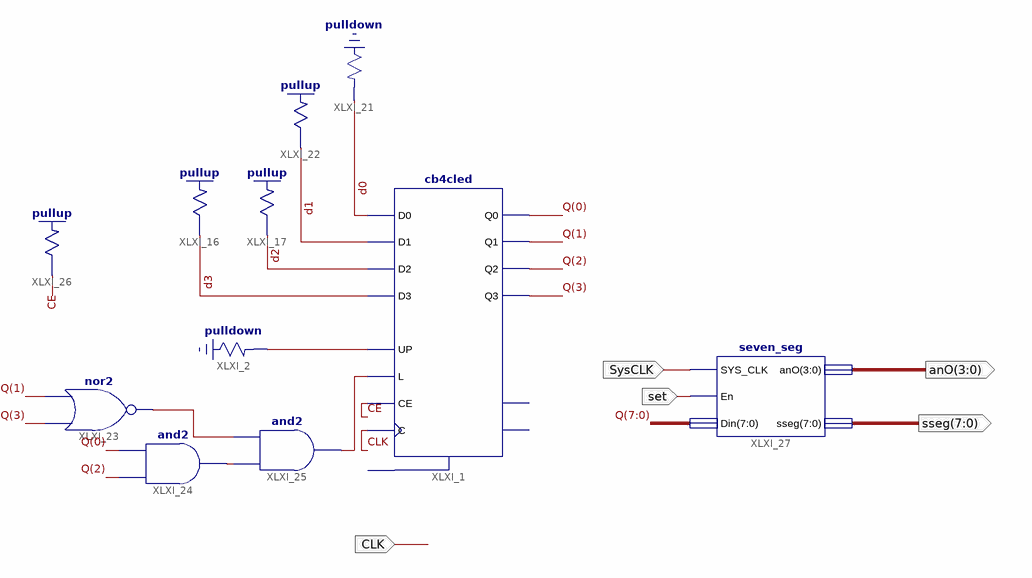
[diagram p0: schematic sheet 1]
// Xilinx ISE schematic Exp6.sch (spartan3e) as structural Verilog: 11 symbols, 5 ports
module Exp6 (
  input  CLK,
  input  set,
  input  SysCLK,
  output [7:0] sseg,
  output [3:0] anO
);

  wire CE, d0, d1, d2, d3, XLXN_25, XLXN_27, XLXN_28, XLXN_29;
  wire [7:0] Q;

  cb4cled XLXI_1 (
    .C(CLK), .CE(CE), .D0(d0), .D1(d1), .D2(d2), .D3(d3), .L(XLXN_29), .UP(XLXN_25), .Q0(Q[0]), .Q1(Q[1]),
    .Q2(Q[2]), .Q3(Q[3]));  // open: CLR, CEO, TC
  \pulldown  XLXI_2 (.O(XLXN_25));
  \pullup  XLXI_16 (.O(d3));
  \pullup  XLXI_17 (.O(d2));
  \pulldown  XLXI_21 (.O(d0));
  \pullup  XLXI_22 (.O(d1));
  nor XLXI_23 (XLXN_28, Q[3], Q[1]);
  and XLXI_24 (XLXN_27, Q[2], Q[0]);
  and XLXI_25 (XLXN_29, XLXN_27, XLXN_28);
  \pullup  XLXI_26 (.O(CE));
  seven_seg XLXI_27 (.SYS_CLK(SysCLK), .En(set), .Din(Q), .anO(anO), .sseg(sseg));
endmodule
